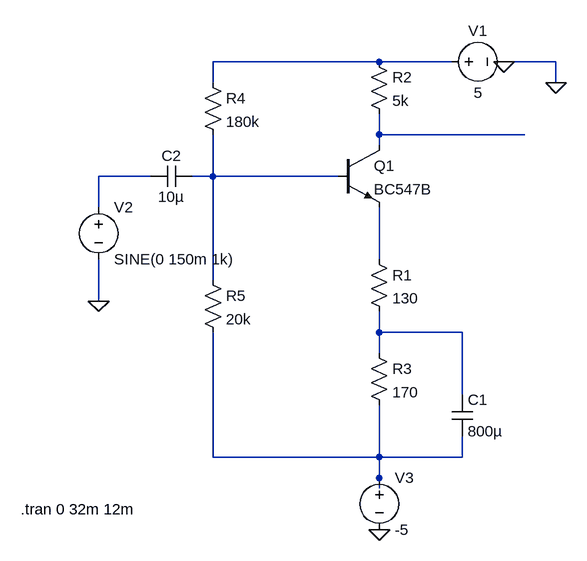
[diagram p0: schematic 2nd-stage(gain).asc]
2nd-stage(gain).asc, the LTspice schematic file:
Version 4.1
SHEET 1 1144 680
WIRE 320 -112 64 -112
WIRE 432 -112 320 -112
WIRE 592 -112 512 -112
WIRE 64 -80 64 -112
WIRE 592 -80 592 -112
WIRE 320 0 320 -32
WIRE 544 0 320 0
WIRE 320 16 320 0
WIRE -32 64 -112 64
WIRE 64 64 64 0
WIRE 64 64 32 64
WIRE 256 64 64 64
WIRE -112 112 -112 64
WIRE 320 192 320 112
WIRE 64 224 64 64
WIRE -112 256 -112 192
WIRE 320 304 320 272
WIRE 448 304 320 304
WIRE 320 336 320 304
WIRE 448 400 448 304
WIRE 64 496 64 304
WIRE 320 496 320 416
WIRE 320 496 64 496
WIRE 448 496 448 464
WIRE 448 496 320 496
WIRE 320 528 320 496
WIRE 320 544 320 528
FLAG 592 -80 0
FLAG -112 256 0
FLAG 512 -112 0
FLAG 320 608 0
SYMBOL npn 256 16 R0
SYMATTR InstName Q1
SYMATTR Value BC547B
SYMBOL res 304 176 R0
SYMATTR InstName R1
SYMATTR Value 130
SYMBOL res 304 -128 R0
SYMATTR InstName R2
SYMATTR Value 5k
SYMBOL res 304 320 R0
SYMATTR InstName R3
SYMATTR Value 170
SYMBOL res 48 -96 R0
SYMATTR InstName R4
SYMATTR Value 180k
SYMBOL res 48 208 R0
SYMATTR InstName R5
SYMATTR Value 20k
SYMBOL cap 432 400 R0
SYMATTR InstName C1
SYMATTR Value 800µ
SYMBOL voltage -112 96 R0
WINDOW 123 0 0 Left 0
WINDOW 39 0 0 Left 0
SYMATTR InstName V2
SYMATTR Value SINE(0 150m 1k)
SYMBOL cap 32 48 R90
WINDOW 0 0 32 VBottom 2
WINDOW 3 32 32 VTop 2
SYMATTR InstName C2
SYMATTR Value 10µ
SYMBOL voltage 416 -112 R270
WINDOW 0 32 56 VTop 2
WINDOW 3 -32 56 VBottom 2
SYMATTR InstName V1
SYMATTR Value 5
SYMBOL voltage 320 512 R0
SYMATTR InstName V3
SYMATTR Value -5
TEXT -232 576 Left 2 !.tran 0 32m 12m

The netlist it stands for:
* 2nd-stage(gain).asc
Q1 N002 N004 N005 0 BC547B
R1 N005 N006 130
R2 N001 N002 5k
R3 N006 N007 170
R4 N001 N004 180k
R5 N004 N007 20k
C1 N006 N007 800µ
V2 N003 0 SINE(0 150m 1k)
C2 N004 N003 10µ
V1 N001 0 5
V3 N007 0 -5
.model NPN NPN
.model PNP PNP
.lib standard.bjt
.tran 0 32m 12m
.backanno
.end